# Altium schematic sheet FOC_Drive.SchDoc
size A3; SheetNumber: 3; SheetTotal: 3
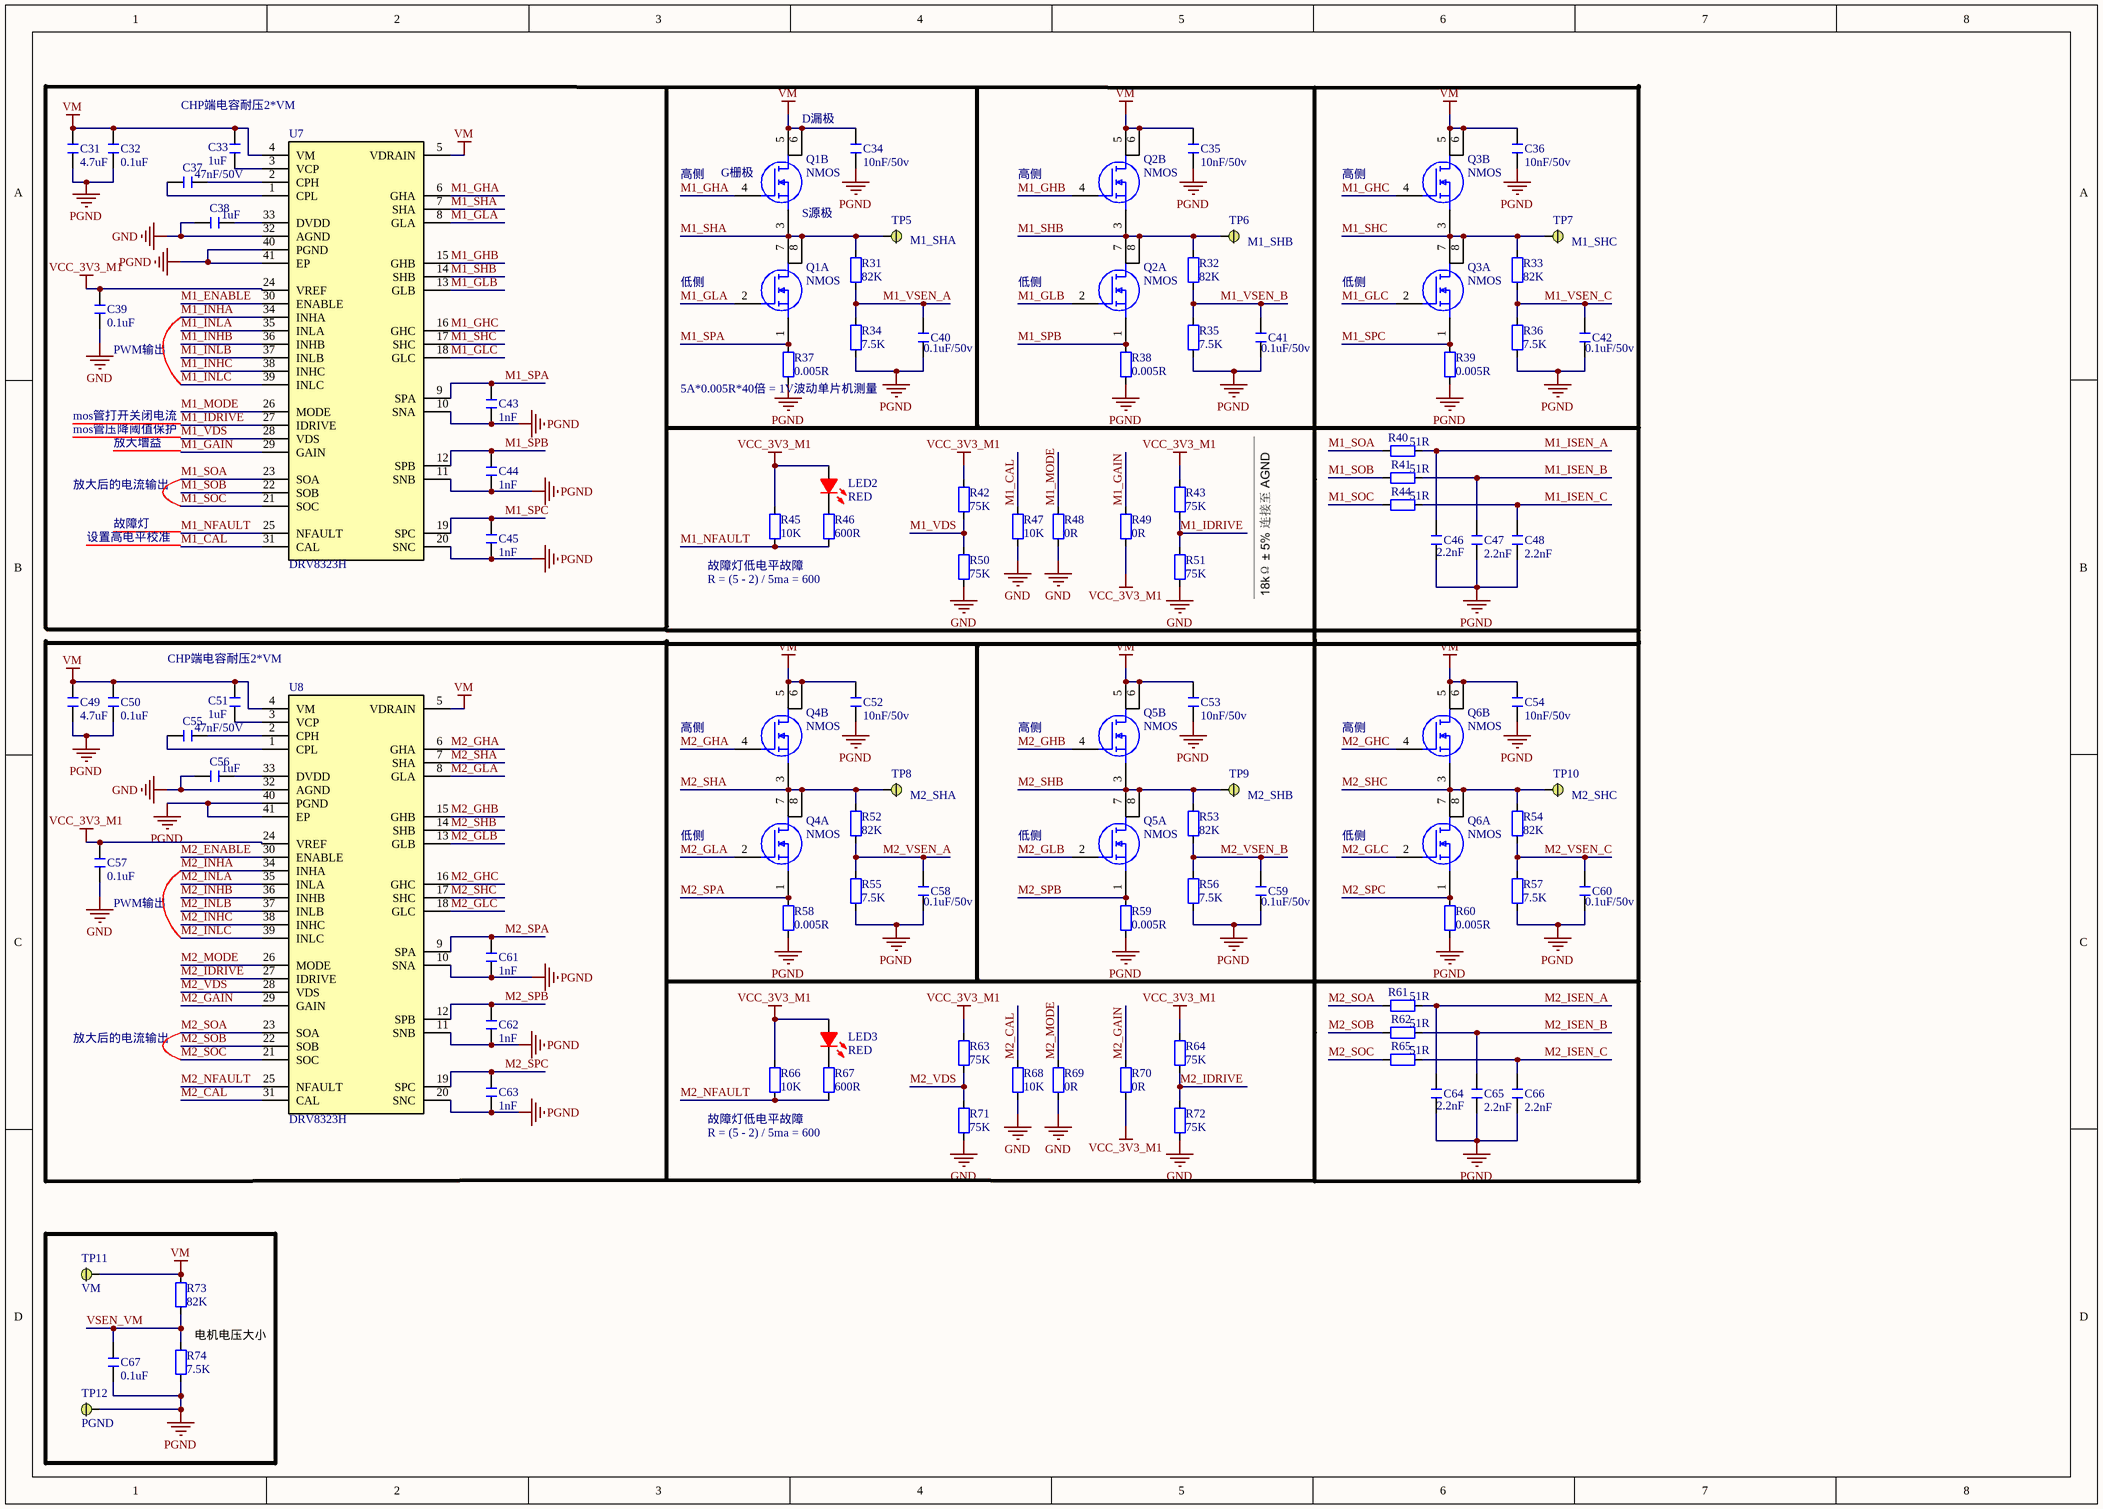
[diagram p0: FOC_Drive.SchDoc]

## Parts
C31  4.7uF  [C 0603_L]
C32  0.1uF  [C 0603_L]
C33  1uF  [C 0603_L]
C34  10nF/50v  [C 0603_L]
C35  10nF/50v  [C 0603_L]
C36  10nF/50v  [C 0603_L]
C37  47nF/50V  [C 0603_L]
C38  1uF  [C 0603_L]
C39  0.1uF  [C 0603_L]
C40  0.1uF/50v  [C 0603_L]
C41  0.1uF/50v  [C 0603_L]
C42  0.1uF/50v  [C 0603_L]
C43  1nF  [C 0603_L]
C44  1nF  [C 0603_L]
C45  1nF  [C 0603_L]
C46  2.2nF  [C 0603_L]
C47  2.2nF  [C 0603_L]
C48  2.2nF  [C 0603_L]
C49  4.7uF  [C 0603_L]
C50  0.1uF  [C 0603_L]
C51  1uF  [C 0603_L]
C52  10nF/50v  [C 0603_L]
C53  10nF/50v  [C 0603_L]
C54  10nF/50v  [C 0603_L]
C55  47nF/50V  [C 0603_L]
C56  1uF  [C 0603_L]
C57  0.1uF  [C 0603_L]
C58  0.1uF/50v  [C 0603_L]
C59  0.1uF/50v  [C 0603_L]
C60  0.1uF/50v  [C 0603_L]
C61  1nF  [C 0603_L]
C62  1nF  [C 0603_L]
C63  1nF  [C 0603_L]
C64  2.2nF  [C 0603_L]
C65  2.2nF  [C 0603_L]
C66  2.2nF  [C 0603_L]
C67  0.1uF  [C 0603_L]
LED2  RED  [LED_0603R]
LED3  RED  [LED_0603R]
Q1  NMOS  [DFN-8_L5.8-W4.9-P1.27-LS6.0-BL]  (parts A,B of 2)
Q2  NMOS  [DFN-8_L5.8-W4.9-P1.27-LS6.0-BL]  (parts A,B of 2)
Q3  NMOS  [DFN-8_L5.8-W4.9-P1.27-LS6.0-BL]  (parts A,B of 2)
Q4  NMOS  [DFN-8_L5.8-W4.9-P1.27-LS6.0-BL]  (parts A,B of 2)
Q5  NMOS  [DFN-8_L5.8-W4.9-P1.27-LS6.0-BL]  (parts A,B of 2)
Q6  NMOS  [DFN-8_L5.8-W4.9-P1.27-LS6.0-BL]  (parts A,B of 2)
R31  82K  [R 0603_L]
R32  82K  [R 0603_L]
R33  82K  [R 0603_L]
R34  7.5K  [R 0603_L]
R35  7.5K  [R 0603_L]
R36  7.5K  [R 0603_L]
R37  0.005R  [R 2512_L]
R38  0.005R  [R 2512_L]
R39  0.005R  [R 2512_L]
R40  51R  [R 0603_L]
R41  51R  [R 0603_L]
R42  75K  [R 0603_L]
R43  75K  [R 0603_L]
R44  51R  [R 0603_L]
R45  10K  [R 0603_L]
R46  600R  [R 0603_L]
R47  10K  [R 0603_L]
R48  0R  [R 0603_L]
R49  0R  [R 0603_L]
R50  75K  [R 0603_L]
R51  75K  [R 0603_L]
R52  82K  [R 0603_L]
R53  82K  [R 0603_L]
R54  82K  [R 0603_L]
R55  7.5K  [R 0603_L]
R56  7.5K  [R 0603_L]
R57  7.5K  [R 0603_L]
R58  0.005R  [R 2512_L]
R59  0.005R  [R 2512_L]
R60  0.005R  [R 2512_L]
R61  51R  [R 0603_L]
R62  51R  [R 0603_L]
R63  75K  [R 0603_L]
R64  75K  [R 0603_L]
R65  51R  [R 0603_L]
R66  10K  [R 0603_L]
R67  600R  [R 0603_L]
R68  10K  [R 0603_L]
R69  0R  [R 0603_L]
R70  0R  [R 0603_L]
R71  75K  [R 0603_L]
R72  75K  [R 0603_L]
R73  82K  [R 0603_L]
R74  7.5K  [R 0603_L]
TP5  M1_SHA  [TP_RECT_2x2]
TP6  M1_SHB  [TP_RECT_2x2]
TP7  M1_SHC  [TP_RECT_2x2]
TP8  M2_SHA  [TP_RECT_2x2]
TP9  M2_SHB  [TP_RECT_2x2]
TP10  M2_SHC  [TP_RECT_2x2]
TP11  VM  [TP_RECT_2x2]
TP12  PGND  [TP_RECT_2x2]
U7  DRV8323H  [QFN50P600X600X80-41N-D]
U8  DRV8323H  [QFN50P600X600X80-41N-D]

## Blocks framed on the sheet
电机电压大小: C67 R73 R74 TP11 TP12

## Nets
GND: C38.1 C39.1 C56.1 C57.1 R47.2 R48.1 R50.2 R51.2 R68.2 R69.1 R71.2 R72.2 U7.32(AGND) U8.32(AGND)
PGND: C31.1 C32.1 C34.1 C35.1 C36.1 C40.1 C41.1 C42.1 C43.2 C44.2 C45.2 C46.1 C47.1 C48.1 C49.1 C50.1 C52.1 C53.1 C54.1 C58.1 C59.1 C60.1 C61.2 C62.2 C63.2 C64.1 C65.1 C66.1 C67.1 R34.1 R35.1 R36.1 R37.1 R38.1 R39.1 R55.1 R56.1 R57.1 R58.1 R59.1 R60.1 R74.2 TP12.1 U7.10(SNA) U7.11(SNB) U7.20(SNC) U7.40(PGND) U7.41(EP) U8.10(SNA) U8.11(SNB) U8.20(SNC) U8.40(PGND) U8.41(EP)
VCC_3V3_M1: C39.2 C57.2 LED2.1(+) LED3.1(+) R42.1 R43.1 R45.1 R49.1 R63.1 R64.1 R66.1 R70.1 U7.24(VREF) U8.24(VREF)
VM: C31.2 C32.2 C33.2 C34.2 C35.2 C36.2 C49.2 C50.2 C51.2 C52.2 C53.2 C54.2 Q1.5(D2) Q1.6(D2) Q2.5(D2) Q2.6(D2) Q3.5(D2) Q3.6(D2) Q4.5(D2) Q4.6(D2) Q5.5(D2) Q5.6(D2) Q6.5(D2) Q6.6(D2) R73.1 TP11.1 U7.4(VM) U7.5(VDRAIN) U8.4(VM) U8.5(VDRAIN)
M1_CAL: R47.1 U7.31(CAL)
M1_ENABLE: U7.30(ENABLE)
M1_GAIN: R49.2 U7.29(GAIN)
M1_GHA: Q1.4(G2) U7.6(GHA)
M1_GHB: Q2.4(G2) U7.15(GHB)
M1_GHC: Q3.4(G2) U7.16(GHC)
M1_GLA: Q1.2(G1) U7.8(GLA)
M1_GLB: Q2.2(G1) U7.13(GLB)
M1_GLC: Q3.2(G1) U7.18(GLC)
M1_IDRIVE: R43.2 R51.1 U7.27(IDRIVE)
M1_INHA: U7.34(INHA)
M1_INHB: U7.36(INHB)
M1_INHC: U7.38(INHC)
M1_INLA: U7.35(INLA)
M1_INLB: U7.37(INLB)
M1_INLC: U7.39(INLC)
M1_ISEN_A: C46.2 R40.1
M1_ISEN_B: C47.2 R41.1
M1_ISEN_C: C48.2 R44.1
M1_MODE: R48.2 U7.26(MODE)
M1_NFAULT: R45.2 R46.2 U7.25(NFAULT)
M1_SHA: Q1.3(S2) Q1.7(D1) Q1.8(D1) R31.2 TP5.1 U7.7(SHA)
M1_SHB: Q2.3(S2) Q2.7(D1) Q2.8(D1) R32.2 TP6.1 U7.14(SHB)
M1_SHC: Q3.3(S2) Q3.7(D1) Q3.8(D1) R33.2 TP7.1 U7.17(SHC)
M1_SOA: R40.2 U7.23(SOA)
M1_SOB: R41.2 U7.22(SOB)
M1_SOC: R44.2 U7.21(SOC)
M1_SPA: C43.1 Q1.1(S1) R37.2 U7.9(SPA)
M1_SPB: C44.1 Q2.1(S1) R38.2 U7.12(SPB)
M1_SPC: C45.1 Q3.1(S1) R39.2 U7.19(SPC)
M1_VDS: R42.2 R50.1 U7.28(VDS)
M1_VSEN_A: C40.2 R31.1 R34.2
M1_VSEN_B: C41.2 R32.1 R35.2
M1_VSEN_C: C42.2 R33.1 R36.2
M2_CAL: R68.1 U8.31(CAL)
M2_ENABLE: U8.30(ENABLE)
M2_GAIN: R70.2 U8.29(GAIN)
M2_GHA: Q4.4(G2) U8.6(GHA)
M2_GHB: Q5.4(G2) U8.15(GHB)
M2_GHC: Q6.4(G2) U8.16(GHC)
M2_GLA: Q4.2(G1) U8.8(GLA)
M2_GLB: Q5.2(G1) U8.13(GLB)
M2_GLC: Q6.2(G1) U8.18(GLC)
M2_IDRIVE: R64.2 R72.1 U8.27(IDRIVE)
M2_INHA: U8.34(INHA)
M2_INHB: U8.36(INHB)
M2_INHC: U8.38(INHC)
M2_INLA: U8.35(INLA)
M2_INLB: U8.37(INLB)
M2_INLC: U8.39(INLC)
M2_ISEN_A: C64.2 R61.1
M2_ISEN_B: C65.2 R62.1
M2_ISEN_C: C66.2 R65.1
M2_MODE: R69.2 U8.26(MODE)
M2_NFAULT: R66.2 R67.2 U8.25(NFAULT)
M2_SHA: Q4.3(S2) Q4.7(D1) Q4.8(D1) R52.2 TP8.1 U8.7(SHA)
M2_SHB: Q5.3(S2) Q5.7(D1) Q5.8(D1) R53.2 TP9.1 U8.14(SHB)
M2_SHC: Q6.3(S2) Q6.7(D1) Q6.8(D1) R54.2 TP10.1 U8.17(SHC)
M2_SOA: R61.2 U8.23(SOA)
M2_SOB: R62.2 U8.22(SOB)
M2_SOC: R65.2 U8.21(SOC)
M2_SPA: C61.1 Q4.1(S1) R58.2 U8.9(SPA)
M2_SPB: C62.1 Q5.1(S1) R59.2 U8.12(SPB)
M2_SPC: C63.1 Q6.1(S1) R60.2 U8.19(SPC)
M2_VDS: R63.2 R71.1 U8.28(VDS)
M2_VSEN_A: C58.2 R52.1 R55.2
M2_VSEN_B: C59.2 R53.1 R56.2
M2_VSEN_C: C60.2 R54.1 R57.2
VSEN_VM: C67.2 R73.2 R74.1
NetC33_1: C33.1 U7.3(VCP)
NetC37_1: C37.1 U7.2(CPH)
NetC37_2: C37.2 U7.1(CPL)
NetC38_2: C38.2 U7.33(DVDD)
NetC51_1: C51.1 U8.3(VCP)
NetC55_1: C55.1 U8.2(CPH)
NetC55_2: C55.2 U8.1(CPL)
NetC56_2: C56.2 U8.33(DVDD)
NetLED2_2: LED2.2(-) R46.1
NetLED3_2: LED3.2(-) R67.1

## Notes on the sheet
- (near C33) CHP端电容耐压2*VM
- 高侧
- (near Q1) G栅极
- D漏极
- (near Q1) S源极
- 低侧
- (near C39) PWM输出
- mos管压降阈值保护
- mos管打开关闭电流
- 放大增益
- (near R37) 5A*0.005R*40倍 = 1V波动单片机测量
- 放大后的电流输出
- 设置高电平校准
- 故障灯
- (near R45) 故障灯低电平故障
- R = (5 - 2) / 5ma = 600
- (near C51) CHP端电容耐压2*VM
- (near C57) PWM输出
- (near R66) 故障灯低电平故障

## Library data of the parts
C31-C67 = C: 贴片电容; BOM名称: 无极性贴片电容
LED2 LED3 = LED_R: 贴片LED 0603 红色
Q1-Q6 = NCEP01ND35AG: NMOS，100V，35A，2 channel
R31-R74 = R: 贴片电阻; BOM名称: 贴片电阻
TP5-TP12 = TP
U7 U8 = DRV8323H: 三相智能栅极驱动器; Manufacturer_Name: Texas Instruments; Datasheet Link: https://www.ti.com/lit/ds/symlink/drv8323.pdf?ts=1615227518000&ref_url=https%253A%252F%252Fwww.google.com%252F; Height: 0.8mm; Manufacturer_Part_Number: DRV8323